# EAGLE design Adapter LK-1 (EAGLE 9.5.2)
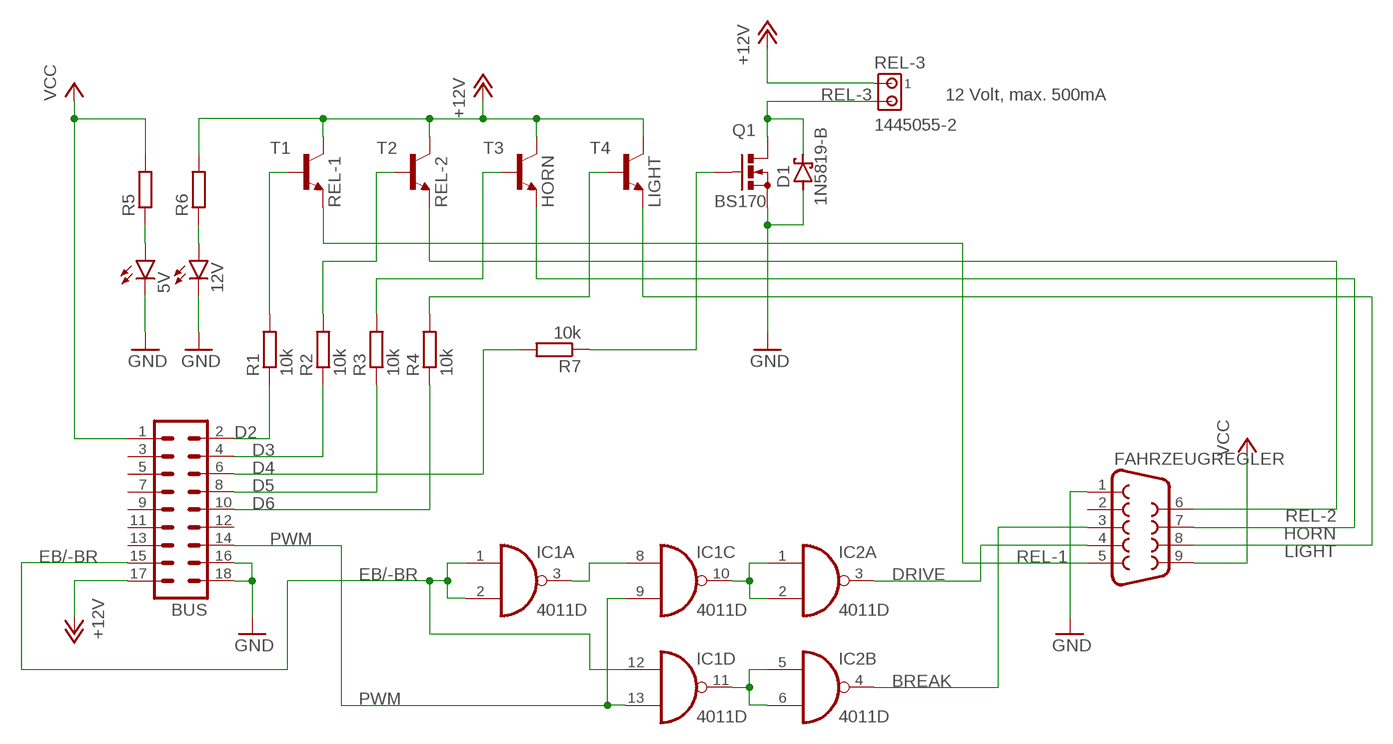
[diagram p0: schematic, sheet 1]

## Parts
5V  LED3MM  [LED3MM]
12V  LED3MM  [LED3MM]
BUS  MA09-2  [MA09-2]
D1  1N5819-B  [DO41-7.6]
FAHRZEUGREGLER  F09HP  [F09HP]
IC1  4011D  [SO14]
IC2  4011D  [SO14]
Q1  BS170  [SOT54E]
R1  10k  R-EU_0204/2V  [0204V]
R2  10k  R-EU_0204/2V  [0204V]
R3  10k  R-EU_0204/2V  [0204V]
R4  10k  R-EU_0204/2V  [0204V]
R5  R-EU_0204/2V  [0204V]
R6  R-EU_0204/2V  [0204V]
R7  10k  R-EU_0204/2V  [0204V]
REL-3  1445055-2  [1445055-2]
T1  -NPN-TO92  [TO92]
T2  -NPN-TO92  [TO92]
T3  -NPN-TO92  [TO92]
T4  -NPN-TO92  [TO92]

## Nets
+12V: BUS.17 R6.2 REL-3.1 T1.3(C) T2.3(C) T3.3(C) T4.3(C)
BREAK: FAHRZEUGREGLER.3 IC2.4(B:O)
D2: BUS.2 R1.1
D3: BUS.4 R2.1
D4: BUS.6 R7.2
D5: BUS.8 R3.1
D6: BUS.10 R4.1
DRIVE: FAHRZEUGREGLER.4 IC2.3(A:O)
EB/-BR: BUS.15 IC1.1(A:I0) IC1.2(A:I1) IC1.12(D:I0)
GND: 5V.K(C) 12V.K(C) BUS.16 BUS.18 D1.A FAHRZEUGREGLER.1 Q1.S
HORN: FAHRZEUGREGLER.7 T3.1(E)
LIGHT: FAHRZEUGREGLER.8 T4.1(E)
N$2: IC1.3(A:O) IC1.8(C:I0)
N$4: R1.2 T1.2(B)
N$5: R2.2 T2.2(B)
N$6: IC1.10(C:O) IC2.1(A:I0) IC2.2(A:I1)
N$7: IC1.11(D:O) IC2.5(B:I0) IC2.6(B:I1)
N$8: R3.2 T3.2(B)
N$9: R4.2 T4.2(B)
N$10: 5V.A R5.1
N$11: 12V.A R6.1
N$13: Q1.G R7.1
PWM: BUS.14 IC1.9(C:I1) IC1.13(D:I1)
REL-1: FAHRZEUGREGLER.5 T1.1(E)
REL-2: FAHRZEUGREGLER.6 T2.1(E)
REL-3: D1.C Q1.D REL-3.2
VCC: BUS.1 FAHRZEUGREGLER.9 R5.2
Unconnected: BUS.3 BUS.5 BUS.7 BUS.9 BUS.11 BUS.12 BUS.13 FAHRZEUGREGLER.2 IC1.4(B:O) IC1.5(B:I0) IC1.6(B:I1) IC2.8(C:I0) IC2.9(C:I1) IC2.10(C:O) IC2.11(D:O) IC2.12(D:I0) IC2.13(D:I1)

## Notes on the sheet
- 12 Volt, max. 500mA

## Power pins joined to a net without a drawn wire
VDD: IC1.14(P:VDD) IC2.14(P:VDD)
VSS: IC1.7(P:VSS) IC2.7(P:VSS)

## Library data of the parts
5V 12V = led:LED: LED OSRAM: - CHIPLED LG R971, LG N971, LY N971, LG Q971, LY Q971, LO R971, LY R971 LH N974, LH R974 LS Q976, LO Q976, LY Q976 LO Q996 - Hyper CHIPLED LW Q18S LB Q993, LB Q99A, LB R99A - SideLED LS A670, LO A670, LY A670, LG A670, LP A670 LB A673, LV A673, LT A673, LW A673 LH A674 LY A675 LS A676, LA A676, LO A676, LY A676, LW A676 LS A679, LY A679, LG A679 - Hyper Micro SIDELED® LS Y876, LA Y876, LO Y876, LY Y876 LT Y87S - SmartLED LW L88C, LW L88S LB L89C, LB L89S, LG L890 LS L89K, LO L89K, LY L89K LS L896, LA L896, LO L896, LY L896 - TOPLED LS T670, LO T670, LY T670, LG T670, LP T670 LSG T670, LSP T670, LSY T670, LOP T670, LYG T670 LG T671, LOG T671, LSG T671 LB T673, LV T673, LT T673, LW T673 LH T674 LS T676, LA T676, LO T676, LY T676, LB T676, LH T676, LSB T676, LW T676 LB T67C, LV T67C, LT T67C, LS T67K, LO T67K, LY T67K, LW E67C LS E67B, LA E67B, LO E67B, LY E67B, LB E67C, LV E67C, LT E67C LW T67C LS T679, LY T679, LG T679 LS T770, LO T770, LY T770, LG T770, LP T770 LB T773, LV T773, LT T773, LW T773 LH T774 LS E675, LA E675, LY E675, LS T675 LS T776, LA T776, LO T776, LY T776, LB T776 LHGB T686 LT T68C, LB T68C - Hyper Mini TOPLED® LB M676 - Mini TOPLED Santana® LG M470 LS M47K, LO M47K, LY M47K Source: http://www.osram.convergy.de LUXEON: - LUMILED® LXK2-PW12-R00, LXK2-PW12-S00, LXK2-PW14-U00, LXK2-PW14-V00 LXK2-PM12-R00, LXK2-PM12-S00, LXK2-PM14-U00 LXK2-PE12-Q00, LXK2-PE12-R00, LXK2-PE12-S00, LXK2-PE14-T00, LXK2-PE14-U00 LXK2-PB12-K00, LXK2-PB12-L00, LXK2-PB12-M00, LXK2-PB14-N00, LXK2-PB14-P00, LXK2-PB14-Q00 LXK2-PR12-L00, LXK2-PR12-M00, LXK2-PR14-Q00, LXK2-PR14-R00 LXK2-PD12-Q00, LXK2-PD12-R00, LXK2-PD12-S00 LXK2-PH12-R00, LXK2-PH12-S00 LXK2-PL12-P00, LXK2-PL12-Q00, LXK2-PL12-R00 Source: www.luxeon.com KINGBRIGHT: KA-3528ASYC Source: www.kingbright.com
BUS = con-lstb:MA09-2: PIN HEADER; OC_FARNELL: unknown; OC_NEWARK: unknown
D1 = diode:1N581*: 1.0A SCHOTTKY BARRIER RECTIFIER Source: http://www.diodes.com/datasheets/ds23001.pdf
FAHRZEUGREGLER = con-subd:F09: SUB-D; OC_FARNELL: unknown; OC_NEWARK: unknown
IC1 IC2 = 40xx:4011: Quad 2-input NAND
Q1 = transistor-small-signal:BS170: N-CHANNEL MOS FET
R1-R7 = rcl:R-EU_: RESISTOR, European symbol; SPICEPREFIX: R
REL-3 = con-amp:1445055-2: Micro MATE-N-LOK Connectors grid 1.5 mm Source: ENG_CD_1445055_A.pdf
T1-T4 = transistor:*-NPN-: NPN Transistror BF959 corrected 2008.03.06

## Board
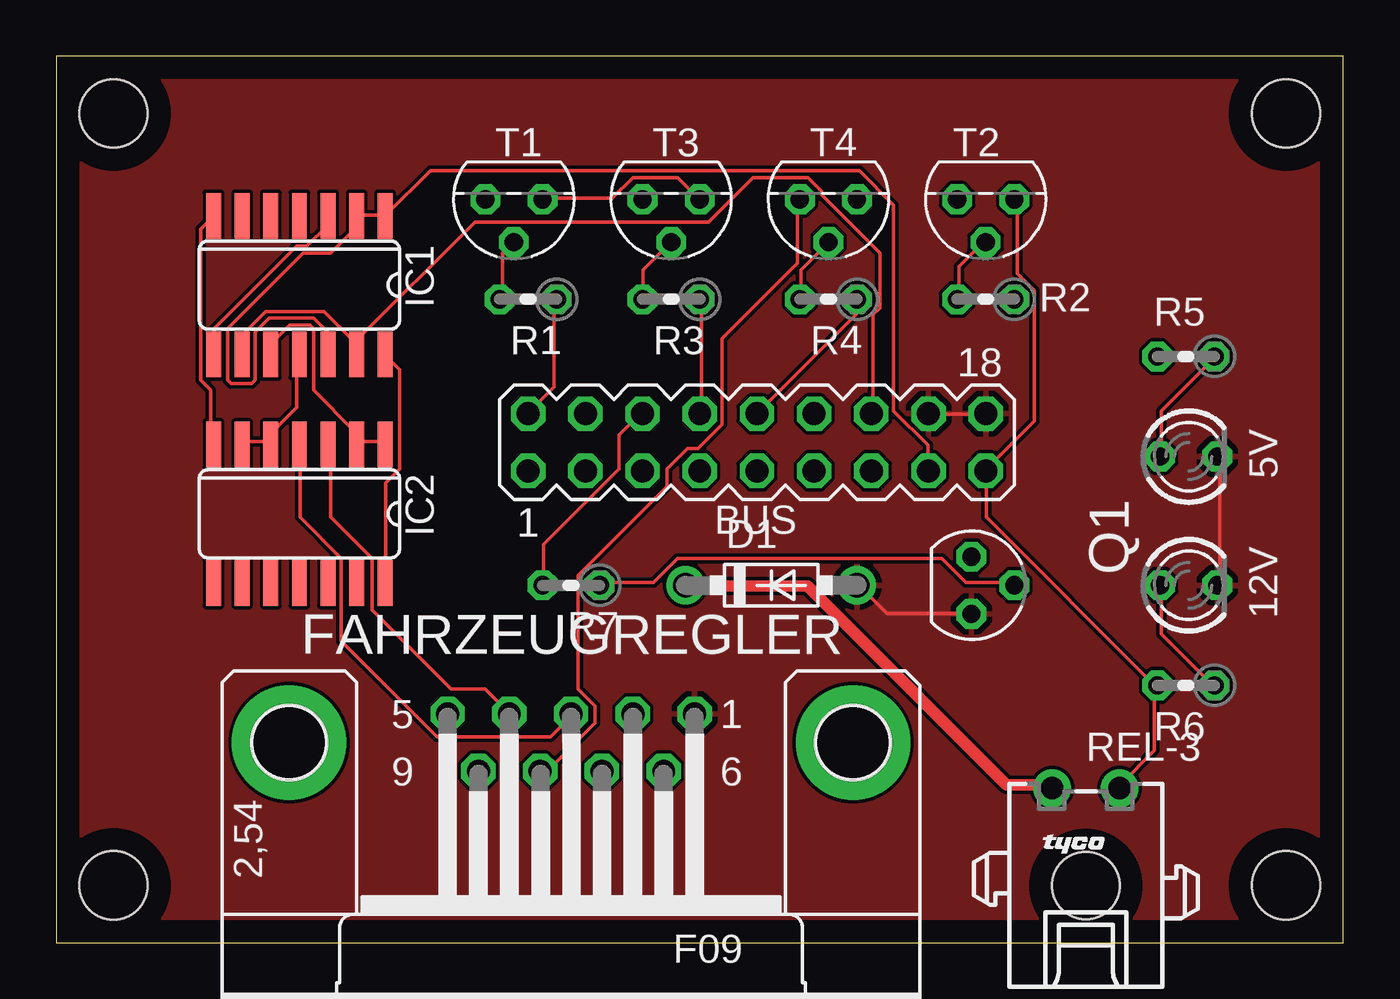
[diagram p1: board, top side]
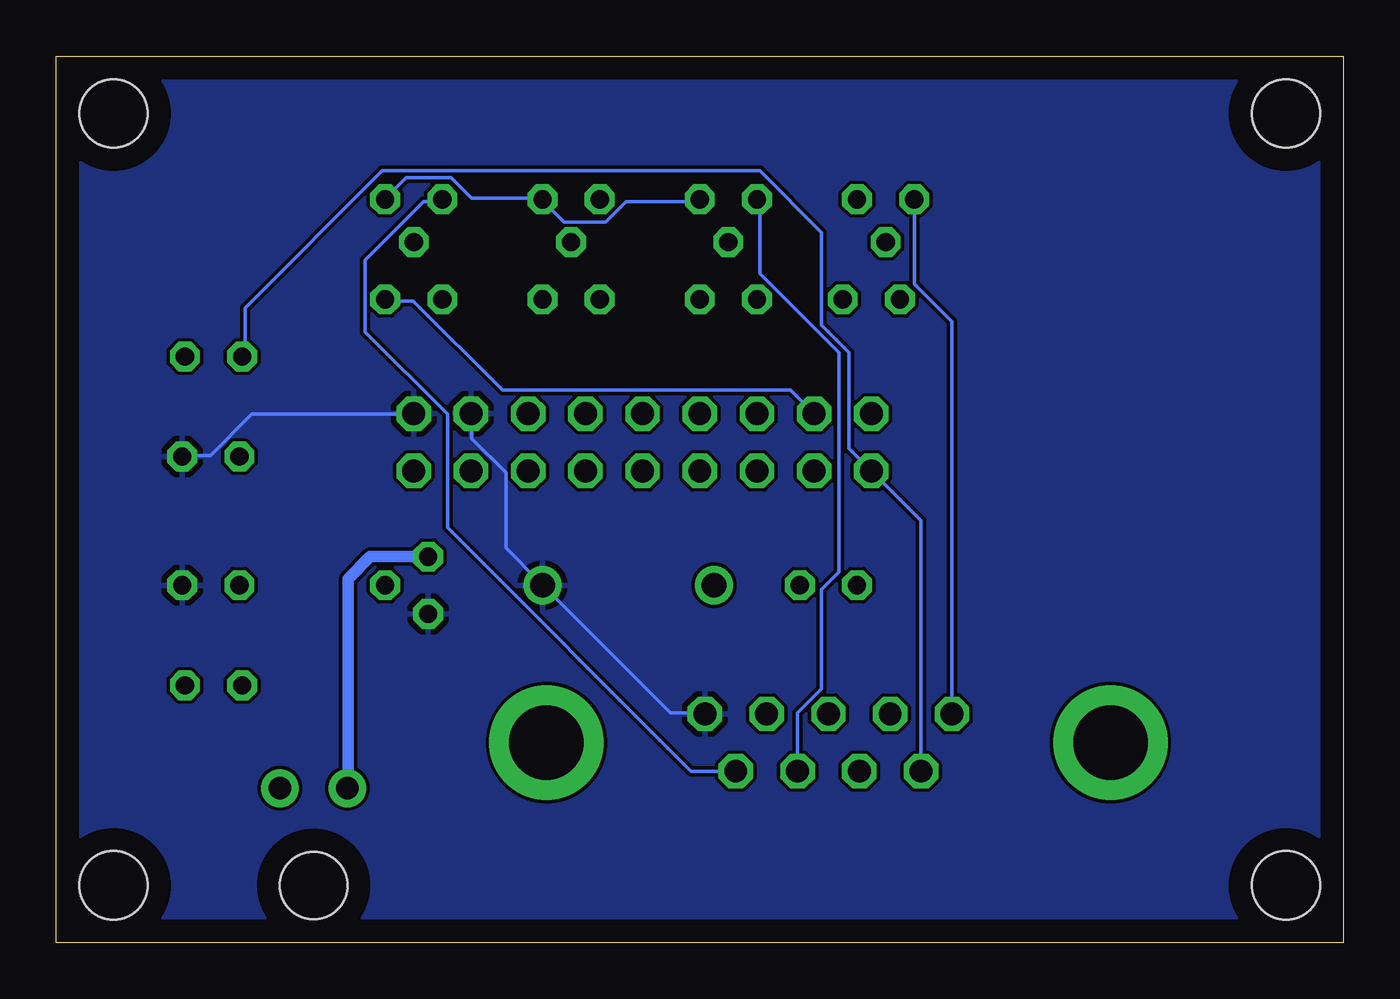
[diagram p2: board, bottom side, seen from below]

Size 57.15 x 39.37 mm. Coordinates in mm from the lower left corner, seen from the top.
Outline: 0,0 57.15,0 57.15,39.37 0,39.37 0,0
Copper layers (1*16): Top 0.035mm / dielectric 1.5mm / Bottom 0.035mm
Design rules "default": minimum track width 6mil, minimum drill 0.35mm, track to track 6mil, track to pad 6mil, pad to pad 6mil, via to via 6mil, smd to smd 6mil, copper to edge 40mil, drill to drill 6mil, minimum pad ring 10mil, minimum via ring 8mil, stop-mask expansion 4mil, vias tented up to drill 0mil, thermal gap 10mil
Holes 3.05 mm at 2.54,2.54 54.61,2.54 54.61,36.83 2.54,36.83

### Footprints (pad centres in the part's own frame; a part is rotated, then mirrored left to right if it is on the bottom)
LED3MM = drill 0.813 octagon: A -1.27,0; K 1.27,0
MA09-2 = drill 1.016 octagon: 1 -10.16,-1.27; 2 -10.16,1.27; 3 -7.62,-1.27; 4 -7.62,1.27; 5 -5.08,-1.27; 6 -5.08,1.27; 7 -2.54,-1.27; 8 -2.54,1.27; 9 0,-1.27; 10 0,1.27; 11 2.54,-1.27; 12 2.54,1.27; 13 5.08,-1.27; 14 5.08,1.27; 15 7.62,-1.27; 16 7.62,1.27; 17 10.16,-1.27; 18 10.16,1.27
DO41-7.6 = drill 1.1 pad 1.7: A 3.81,0; C -3.81,0
F09HP = drill 1.016 octagon: 1 -5.486,-1.27; 2 -2.743,-1.27; 3 0,-1.27; 4 2.743,-1.27; 5 5.486,-1.27; 6 -4.115,1.27; 7 -1.372,1.27; 8 1.372,1.27; 9 4.115,1.27 | drill 3.302 pad 5.08: G1 -12.522,0; G2 12.522,0
SO14 = smd 0.66 x 2.032: 1 -3.81,-3.073; 2 -2.54,-3.073; 3 -1.27,-3.073; 4 0,-3.073; 5 1.27,-3.073; 6 2.54,-3.073; 7 3.81,-3.073; 8 3.81,3.073; 9 2.54,3.073; 10 1.27,3.073; 11 0,3.073; 12 -1.27,3.073; 13 -2.54,3.073; 14 -3.81,3.073
SOT54E = drill 0.813 octagon: D -1.27,0; G 0,1.905; S 1.27,0
0204V = drill 0.813 octagon: 1 -1.27,0; 2 1.27,0
1445055-2 = drill 1 pad 1.676: 1 1.5,4.32; 2 -1.5,4.32 | hole 3: 0,0
TO92 = drill 0.813 octagon: 1 1.27,0; 2 0,1.905; 3 -1.27,0

### Placement (x,y rotation side)
5V  50.29,21.59 0 top
12V  50.29,15.88 0 top
BUS  31.11,22.23 0 top
D1  31.75,15.88 0 top
FAHRZEUGREGLER  22.86,8.89 180 top
IC1  10.79,29.21 180 top
IC2  10.79,19.05 180 top
Q1  40.64,15.88 270 top
R1  20.95,28.57 180 top
R2  41.27,28.57 180 top
R3  27.3,28.57 180 top
R4  34.29,28.57 180 top
R5  50.16,26.04 180 top
R6  50.16,11.43 180 top
R7  22.86,15.88 180 top
REL-3  45.72,2.54 0 top
T1  20.32,33.02 180 top
T2  41.27,33.02 180 top
T3  27.3,33.02 180 top
T4  34.29,33.02 180 top

### Tracks (layer width: path | path; a pad name or v marks a point on that pad's centre or on a via)
+12V
  Top 0.152: T1.3 21.64,33.07 24.69,33.07 25.6,33.98 27.58,33.98 28.5,33.07 T3.3 | 48.77,11.43 48.77,8.53 47.24,7.01 REL-3.1 | 48.77,11.43 41.3,18.9 41.3,20.88 BUS.17 41.3,21.03 43.43,23.16 43.43,28.96 42.67,29.72 42.67,32.92 T2.3 | 48.77,11.43 R6.2
  Bottom 0.152: T2.3 42.52,33.07 41.6,33.98 39.62,33.98 38.71,33.07 35.66,33.07 T4.3 35.51,32.92 34.59,32 32.77,32 31.85,32.92 28.65,32.92 T3.3
BREAK
  Top 0.152: IC2.4 10.82,22.1 10.82,18.9 12.65,17.07 12.65,13.41 16.92,9.14 21.95,9.14 22.86,10.06 FAHRZEUGREGLER.3
D2
  Top 0.152: R1.1 22.1,28.5 22.1,24.69 21.03,23.62 BUS.2
D3
  Bottom 0.152: BUS.4 24.54,24.54 37.34,24.54 41.3,28.5 42.52,28.5 R2.1
D4
  Top 0.152: R7.2 21.64,16 21.64,17.68 24.99,21.03 24.99,22.55 25.91,23.47 BUS.6
D5
  Top 0.152: R3.1 28.65,28.5 28.65,23.62 BUS.8
D6
  Top 0.152: BUS.10 35.51,27.89 35.51,28.5 R4.1
DRIVE
  Top 0.152: IC2.3 12.19,22.1 12.19,18.9 14.02,17.07 14.02,14.78 17.53,11.28 19.05,11.28 20.12,10.21 FAHRZEUGREGLER.4
EB/-BR
  Top 0.152: IC1.12 12.04,26.21 12.04,27.13 11.43,27.74 9.45,27.74 8.84,27.13 8.84,24.99 8.69,24.84 7.77,24.84 7.62,24.99 7.62,27.28 10.97,30.63 12.19,30.63 13.26,31.7 13.26,32.16 IC1.2 13.41,32.31 14.48,32.31 IC1.1 16.61,34.29 35.66,34.29 37.19,32.77 37.19,23.62 38.71,22.1 38.71,21.03 BUS.15
GND
  Top 0.152: 12V.K 51.66,16 51.66,21.49 5V.K | BUS.16 38.86,23.47 41.15,23.47 BUS.18 | Q1.S 40.54,14.63 36.88,14.63 35.66,15.85 D1.A
  Bottom 0.152: FAHRZEUGREGLER.1 28.35,10.21 29.87,10.21 35.51,15.85 D1.A 35.66,16 37.19,17.53 37.19,20.88 38.71,22.4 38.71,23.47 BUS.16 | 5V.K 51.51,21.64 50.29,21.64 48.46,23.47 41.3,23.47 BUS.18
  pour Top: 0,39.37 57.15,39.37 57.15,0 0,0
  pour Bottom: 0,39.37 57.15,39.37 57.15,0 0,0
HORN
  Bottom 0.152: FAHRZEUGREGLER.7 24.23,10.21 23.16,11.28 23.16,15.7 22.4,16.46 22.4,26.21 25.91,29.72 25.91,32.92 T3.1
LIGHT
  Top 0.152: FAHRZEUGREGLER.8 21.79,7.62 23.93,9.75 23.93,10.52 23.16,11.28 23.16,16.31 27.13,20.27 27.13,21.03 28.04,21.95 28.5,21.95 29.57,23.01 29.57,26.82 32.92,30.18 32.92,32.92 T4.1
N$2
  Top 0.152: IC1.8 7.01,26.21 7.01,27.28 10.67,30.94 11.12,30.94 12.04,31.85 12.04,32.16 IC1.3
N$4
  Top 0.152: R1.2 19.81,28.65 19.81,30.63 20.27,31.09 T1.2
N$5
  Top 0.152: R2.2 40.08,28.65 40.08,30.02 41.15,31.09 T2.2
N$6
  Top 0.152: IC2.1 14.48,22.25 13.41,22.25 IC2.2 13.26,22.25 13.26,22.71 11.43,24.54 11.43,27.28 11.28,27.43 10.36,27.43 9.6,26.67 9.6,26.21 IC1.10
N$7
  Top 0.152: IC2.6 8.38,22.25 9.45,22.25 IC2.5 9.6,22.25 9.6,22.71 10.67,23.77 10.67,26.06 IC1.11
N$8
  Top 0.152: T3.2 26.06,29.87 26.06,28.65 R3.2
N$9
  Top 0.152: R4.2 33.07,28.65 33.07,29.87 34.29,31.09 T4.2
N$10
  Top 0.152: 5V.A 49.07,21.64 49.07,23.62 51.36,25.91 R5.1
N$11
  Top 0.152: 12V.A 49.07,15.85 49.07,13.72 51.36,11.43 R6.1
N$13
  Top 0.152: R7.1 24.23,16 26.52,16 27.58,17.07 39.32,17.07 40.39,16 42.52,16 Q1.G
PWM
  Top 0.152: 13.26,26.67 11.89,28.04 9.3,28.04 8.38,27.13 8.38,26.21 IC1.9 | 13.26,26.67 13.26,26.21 IC1.13 13.26,26.67 | 13.26,26.67 18.59,32 28.96,32 30.94,33.98 33.38,33.98 33.98,33.38 33.98,33.22 36.58,30.63 36.58,28.19 36.27,27.89 36.27,23.62 BUS.14
REL-1
  Bottom 0.152: T1.1 19.05,29.26 17.37,27.58 FAHRZEUGREGLER.5
REL-2
  Bottom 0.152: FAHRZEUGREGLER.6 28.96,7.62 39.78,18.44 39.78,23.47 43.43,27.13 43.43,30.33 40.84,32.92 40.08,32.92 T2.1
REL-3
  Top 0.508: D1.C 28.04,15.85 33.35,15.85 42.19,7.01 44.2,7.01 REL-3.2
  Bottom 0.508: Q1.D 43.2,17.14 44.2,16.15 44.2,7.01 REL-3.2
VCC
  Bottom 0.152: R5.2 48.77,26.06 48.77,28.19 42.67,34.29 25.91,34.29 23.16,31.55 23.16,27.43 21.95,26.21 21.95,21.95 BUS.1 18.75,18.75 FAHRZEUGREGLER.9
VDD
  Top 0.152: IC2.14 14.63,16 14.63,20.42 15.24,21.03 15.24,25.45 14.63,26.06 IC1.14
VSS
  Top 0.152: IC1.7 6.4,31.7 6.4,24.99 6.86,24.54 6.86,22.25 IC2.7